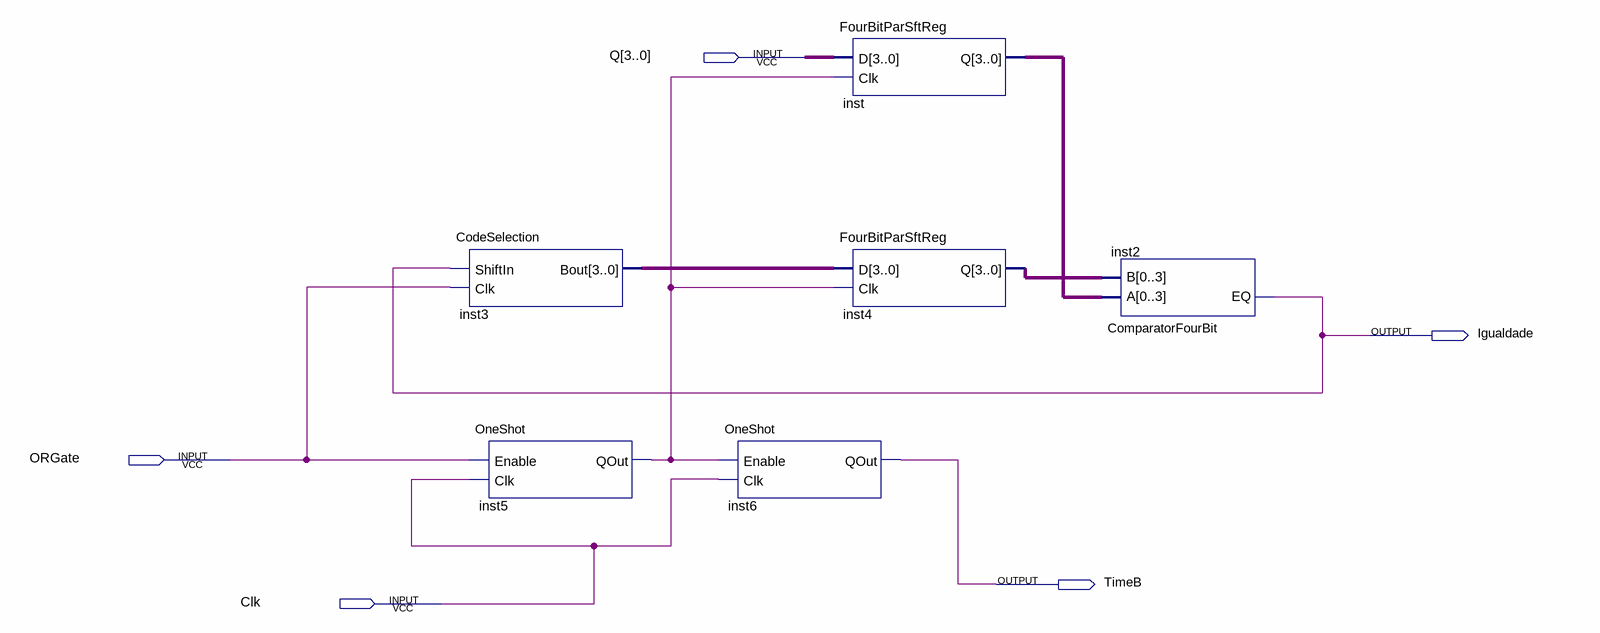
[diagram p0: schematic sheet]
// Quartus schematic Sistema.bdf as structural Verilog: 6 symbols, 5 pins
module Sistema (
  input  [3:0] Q,
  input  ORGate,
  input  Clk,
  output Igualdade,
  output TimeB
);

  wire inst5_qout;
  wire [3:0] inst3_bout, inst4_q, inst_q;

  CodeSelection inst3 (.ShiftIn(Igualdade), .Clk(ORGate), .Bout(inst3_bout));
  OneShot inst5 (.Enable(ORGate), .Clk(Clk), .QOut(inst5_qout));
  OneShot inst6 (.Enable(inst5_qout), .Clk(Clk), .QOut(TimeB));
  FourBitParSftReg inst (.D(Q), .Clk(inst5_qout), .Q(inst_q));
  FourBitParSftReg inst4 (.D(inst3_bout), .Clk(inst5_qout), .Q(inst4_q));
  ComparatorFourBit inst2 (.A(inst_q), .B(inst4_q), .EQ(Igualdade));
endmodule
